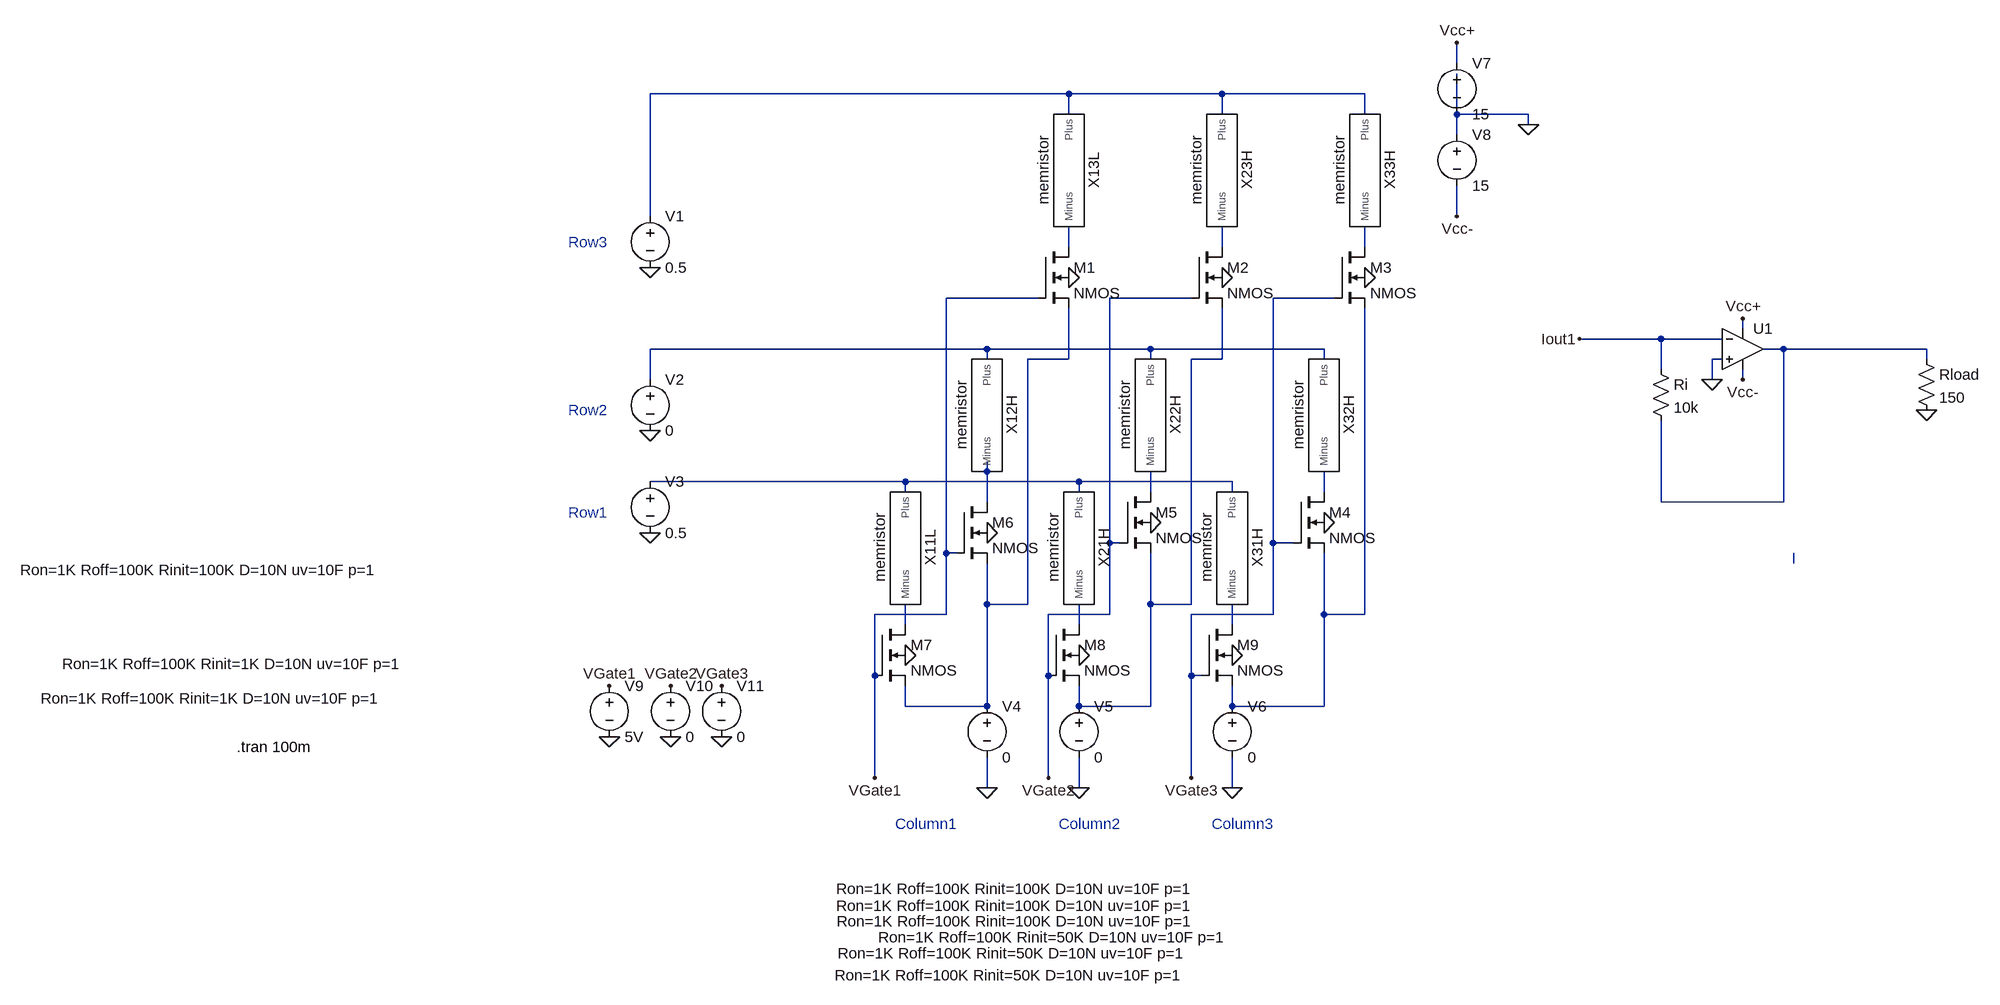
[diagram p0: schematic PassiveCrossbar1R1T.asc]
PassiveCrossbar1R1T.asc, the LTspice schematic file:
Version 4.1
SHEET 1 1304 872
WIRE 480 -576 480 -608
WIRE -128 -528 -784 -528
WIRE 112 -528 -128 -528
WIRE 336 -528 112 -528
WIRE -128 -496 -128 -528
WIRE 112 -496 112 -528
WIRE 336 -496 336 -528
WIRE 480 -496 480 -560
WIRE 592 -496 480 -496
WIRE 592 -480 592 -496
WIRE 480 -464 480 -496
WIRE -784 -336 -784 -528
WIRE 480 -336 480 -384
WIRE -128 -288 -128 -320
WIRE 112 -288 112 -320
WIRE 336 -288 336 -320
WIRE -176 -208 -320 -208
WIRE 64 -208 -64 -208
WIRE 288 -208 192 -208
WIRE 928 -160 928 -176
WIRE 800 -144 672 -144
WIRE 896 -144 800 -144
WIRE -256 -128 -784 -128
WIRE 0 -128 -256 -128
WIRE 272 -128 0 -128
WIRE 992 -128 960 -128
WIRE 1216 -128 992 -128
WIRE -256 -112 -256 -128
WIRE -128 -112 -128 -192
WIRE -128 -112 -192 -112
WIRE 0 -112 0 -128
WIRE 112 -112 112 -192
WIRE 112 -112 64 -112
WIRE 272 -112 272 -128
WIRE 896 -112 880 -112
WIRE 1216 -112 1216 -128
WIRE 800 -96 800 -144
WIRE -784 -80 -784 -128
WIRE 880 -80 880 -112
WIRE 928 -80 928 -96
WIRE -256 64 -256 48
WIRE -384 80 -784 80
WIRE -112 80 -384 80
WIRE 128 80 -112 80
WIRE -384 96 -384 80
WIRE -112 96 -112 80
WIRE 0 96 0 64
WIRE 128 96 128 80
WIRE 272 96 272 64
WIRE -256 112 -256 64
WIRE 800 112 800 -16
WIRE 992 112 992 -128
WIRE 992 112 800 112
WIRE -64 176 -64 -208
WIRE -48 176 -64 176
WIRE 192 176 192 -208
WIRE 224 176 192 176
WIRE -320 192 -320 -208
WIRE -304 192 -320 192
WIRE 1008 208 1008 192
WIRE -256 272 -256 208
WIRE -192 272 -192 -112
WIRE -192 272 -256 272
WIRE 0 272 0 192
WIRE 64 272 64 -112
WIRE 64 272 0 272
WIRE -320 288 -320 192
WIRE -320 288 -432 288
WIRE -64 288 -64 176
WIRE -64 288 -160 288
WIRE 192 288 192 176
WIRE 192 288 64 288
WIRE 272 288 272 192
WIRE 336 288 336 -192
WIRE 336 288 272 288
WIRE -384 304 -384 272
WIRE -112 304 -112 272
WIRE 128 304 128 272
WIRE -432 384 -432 288
WIRE -160 384 -160 288
WIRE 64 384 64 288
WIRE 80 384 64 384
WIRE -384 432 -384 400
WIRE -256 432 -256 272
WIRE -256 432 -384 432
WIRE -112 432 -112 400
WIRE 0 432 0 272
WIRE 0 432 -112 432
WIRE 128 432 128 400
WIRE 272 432 272 288
WIRE 272 432 128 432
WIRE -432 544 -432 384
WIRE -160 544 -160 384
WIRE 64 544 64 384
WIRE -256 560 -256 512
WIRE -112 560 -112 512
WIRE 128 560 128 512
FLAG -784 -256 0
FLAG -784 0 0
FLAG -784 160 0
FLAG -112 560 0
FLAG 128 560 0
FLAG 592 -480 0
FLAG 480 -608 Vcc+
FLAG 928 -176 Vcc+
FLAG 480 -336 Vcc-
FLAG 672 -144 Iout1
FLAG 928 -80 Vcc-
FLAG 880 -80 0
FLAG 1216 -32 0
FLAG -256 560 0
FLAG -384 352 0
FLAG -256 160 0
FLAG 0 144 0
FLAG 272 144 0
FLAG 128 352 0
FLAG -112 352 0
FLAG -128 -240 0
FLAG 112 -240 0
FLAG 336 -240 0
FLAG -432 544 VGate1
FLAG -160 544 VGate2
FLAG 64 544 VGate3
FLAG -848 400 VGate1
FLAG -752 400 VGate2
FLAG -672 400 VGate3
FLAG -848 480 0
FLAG -752 480 0
FLAG -672 480 0
SYMBOL memristor -384 176 R90
WINDOW 39 205 1058 VBottom 2
SYMATTR SpiceLine Ron=1K Roff=100K Rinit=1K D=10N uv=10F p=1
SYMATTR InstName X11L
SYMBOL voltage -784 -96 R0
WINDOW 123 0 0 Left 0
WINDOW 39 0 0 Left 0
SYMATTR InstName V2
SYMATTR Value 0
SYMBOL voltage -784 64 R0
WINDOW 123 0 0 Left 0
WINDOW 39 0 0 Left 0
SYMATTR InstName V3
SYMATTR Value 0.5
SYMBOL voltage -112 416 R0
WINDOW 123 0 0 Left 0
WINDOW 39 0 0 Left 0
SYMATTR InstName V5
SYMATTR Value 0
SYMBOL voltage 128 416 R0
WINDOW 123 0 0 Left 0
WINDOW 39 0 0 Left 0
SYMATTR InstName V6
SYMATTR Value 0
SYMBOL memristor -112 176 R90
WINDOW 39 558 104 VBottom 2
SYMATTR SpiceLine Ron=1K Roff=100K Rinit=100K D=10N uv=10F p=1
SYMATTR InstName X21H
SYMBOL memristor 128 176 R90
WINDOW 39 659 348 VBottom 2
SYMATTR SpiceLine Ron=1K Roff=100K Rinit=50K D=10N uv=10F p=1
SYMATTR InstName X31H
SYMBOL memristor 272 -32 R90
WINDOW 39 842 429 VBottom 2
SYMATTR SpiceLine Ron=1K Roff=100K Rinit=50K D=10N uv=10F p=1
SYMATTR InstName X32H
SYMBOL memristor 0 -32 R90
WINDOW 39 792 216 VBottom 2
SYMATTR SpiceLine Ron=1K Roff=100K Rinit=100K D=10N uv=10F p=1
SYMATTR InstName X22H
SYMBOL memristor -256 -32 R90
WINDOW 39 817 -41 VBottom 2
SYMATTR SpiceLine Ron=1K Roff=100K Rinit=100K D=10N uv=10F p=1
SYMATTR InstName X12H
SYMBOL memristor -128 -416 R90
WINDOW 39 851 1348 VBottom 2
SYMATTR SpiceLine Ron=1K Roff=100K Rinit=1K D=10N uv=10F p=1
SYMATTR InstName X13L
SYMBOL memristor 112 -416 R90
WINDOW 39 650 1606 VBottom 2
SYMATTR SpiceLine Ron=1K Roff=100K Rinit=100K D=10N uv=10F p=1
SYMATTR InstName X23H
SYMBOL memristor 336 -416 R90
WINDOW 39 1285 561 VBottom 2
SYMATTR SpiceLine Ron=1K Roff=100K Rinit=50K D=10N uv=10F p=1
SYMATTR InstName X33H
SYMBOL voltage -784 -352 R0
WINDOW 123 0 0 Left 0
WINDOW 39 0 0 Left 0
SYMATTR InstName V1
SYMATTR Value 0.5
SYMBOL voltage 480 -592 R0
WINDOW 123 0 0 Left 0
WINDOW 39 0 0 Left 0
SYMATTR InstName V7
SYMATTR Value 15
SYMBOL voltage 480 -480 R0
WINDOW 123 0 0 Left 0
WINDOW 39 0 0 Left 0
SYMATTR InstName V8
SYMATTR Value 15
SYMBOL OpAmps\\UniversalOpAmp2 928 -128 R0
SYMATTR InstName U1
SYMBOL res 784 -112 R0
SYMATTR InstName Ri
SYMATTR Value 10k
SYMBOL res 1200 -128 R0
SYMATTR InstName Rload
SYMATTR Value 150
SYMBOL nmos4 -176 -288 R0
SYMATTR InstName M1
SYMBOL nmos4 64 -288 R0
SYMATTR InstName M2
SYMBOL nmos4 288 -288 R0
SYMATTR InstName M3
SYMBOL nmos4 224 96 R0
SYMATTR InstName M4
SYMBOL nmos4 -48 96 R0
SYMATTR InstName M5
SYMBOL nmos4 -304 112 R0
SYMATTR InstName M6
SYMBOL nmos4 -432 304 R0
SYMATTR InstName M7
SYMBOL nmos4 -160 304 R0
SYMATTR InstName M8
SYMBOL nmos4 80 304 R0
SYMATTR InstName M9
SYMBOL voltage -256 416 R0
WINDOW 123 0 0 Left 0
WINDOW 39 0 0 Left 0
SYMATTR InstName V4
SYMATTR Value 0
SYMBOL voltage -848 384 R0
WINDOW 123 0 0 Left 0
WINDOW 39 0 0 Left 0
SYMATTR InstName V9
SYMATTR Value 5V
SYMBOL voltage -752 384 R0
WINDOW 123 0 0 Left 0
WINDOW 39 0 0 Left 0
SYMATTR InstName V10
SYMATTR Value 0
SYMBOL voltage -672 384 R0
WINDOW 123 0 0 Left 0
WINDOW 39 0 0 Left 0
SYMATTR InstName V11
SYMATTR Value 0
TEXT -912 128 Left 2 ;Row1
TEXT -400 616 Left 2 ;Column1
TEXT -1432 496 Left 2 !.tran 100m
TEXT -912 -32 Left 2 ;Row2
TEXT -912 -296 Left 2 ;Row3
TEXT -144 616 Left 2 ;Column2
TEXT 96 616 Left 2 ;Column3

The netlist it stands for:
* PassiveCrossbar1R1T.asc
X§X11L N010 N015 memristor Ron=1K Roff=100K Rinit=1K D=10N uv=10F p=1  ; pins Plus Minus
V2 N005 0 0
V3 N010 0 0.5
V5 N008 0 0
V6 N014 0 0
X§X21H N010 N016 memristor Ron=1K Roff=100K Rinit=100K D=10N uv=10F p=1  ; pins Plus Minus
X§X31H N010 N017 memristor Ron=1K Roff=100K Rinit=50K D=10N uv=10F p=1  ; pins Plus Minus
X§X32H N005 N012 memristor Ron=1K Roff=100K Rinit=50K D=10N uv=10F p=1  ; pins Plus Minus
X§X22H N005 N011 memristor Ron=1K Roff=100K Rinit=100K D=10N uv=10F p=1  ; pins Plus Minus
X§X12H N005 N009 memristor Ron=1K Roff=100K Rinit=100K D=10N uv=10F p=1  ; pins Plus Minus
X§X13L N001 N002 memristor Ron=1K Roff=100K Rinit=1K D=10N uv=10F p=1  ; pins Plus Minus
X§X23H N001 N003 memristor Ron=1K Roff=100K Rinit=100K D=10N uv=10F p=1  ; pins Plus Minus
X§X33H N001 N004 memristor Ron=1K Roff=100K Rinit=50K D=10N uv=10F p=1  ; pins Plus Minus
V1 N001 0 0.5
V7 Vcc+ 0 15
V8 0 Vcc- 15
X§U1 0 Iout1 Vcc+ Vcc- N006 level2 Avol=1Meg GBW=10Meg Slew=10Meg Ilimit=25m Rail=0 Vos=0 En=0 Enk=0 In=0 Ink=0 Rin=500Meg  ; pins In+ In- V+ V- OUT
Ri Iout1 N006 10k
Rload N006 0 150
M1 N002 VGate1 N007 0 NMOS
M2 N003 VGate2 N008 0 NMOS
M3 N004 VGate3 N014 0 NMOS
M4 N012 VGate3 N014 0 NMOS
M5 N011 VGate2 N008 0 NMOS
M6 N009 VGate1 N007 0 NMOS
M7 N015 VGate1 N007 0 NMOS
M8 N016 VGate2 N008 0 NMOS
M9 N017 VGate3 N014 0 NMOS
V4 N007 0 0
V9 VGate1 0 5V
V10 VGate2 0 0
V11 VGate3 0 0
.model NMOS NMOS
.model PMOS PMOS
.lib standard.mos
* Row1
* Column1
.tran 100m
* Row2
* Row3
* Column2
* Column3
.lib C:\Users\daris\Documents\LTspice\memristor.sub
.lib UniversalOpAmp2.lib
.backanno
.end